# EAGLE schematic buttons+tft-fix (EAGLE 9.2.2)
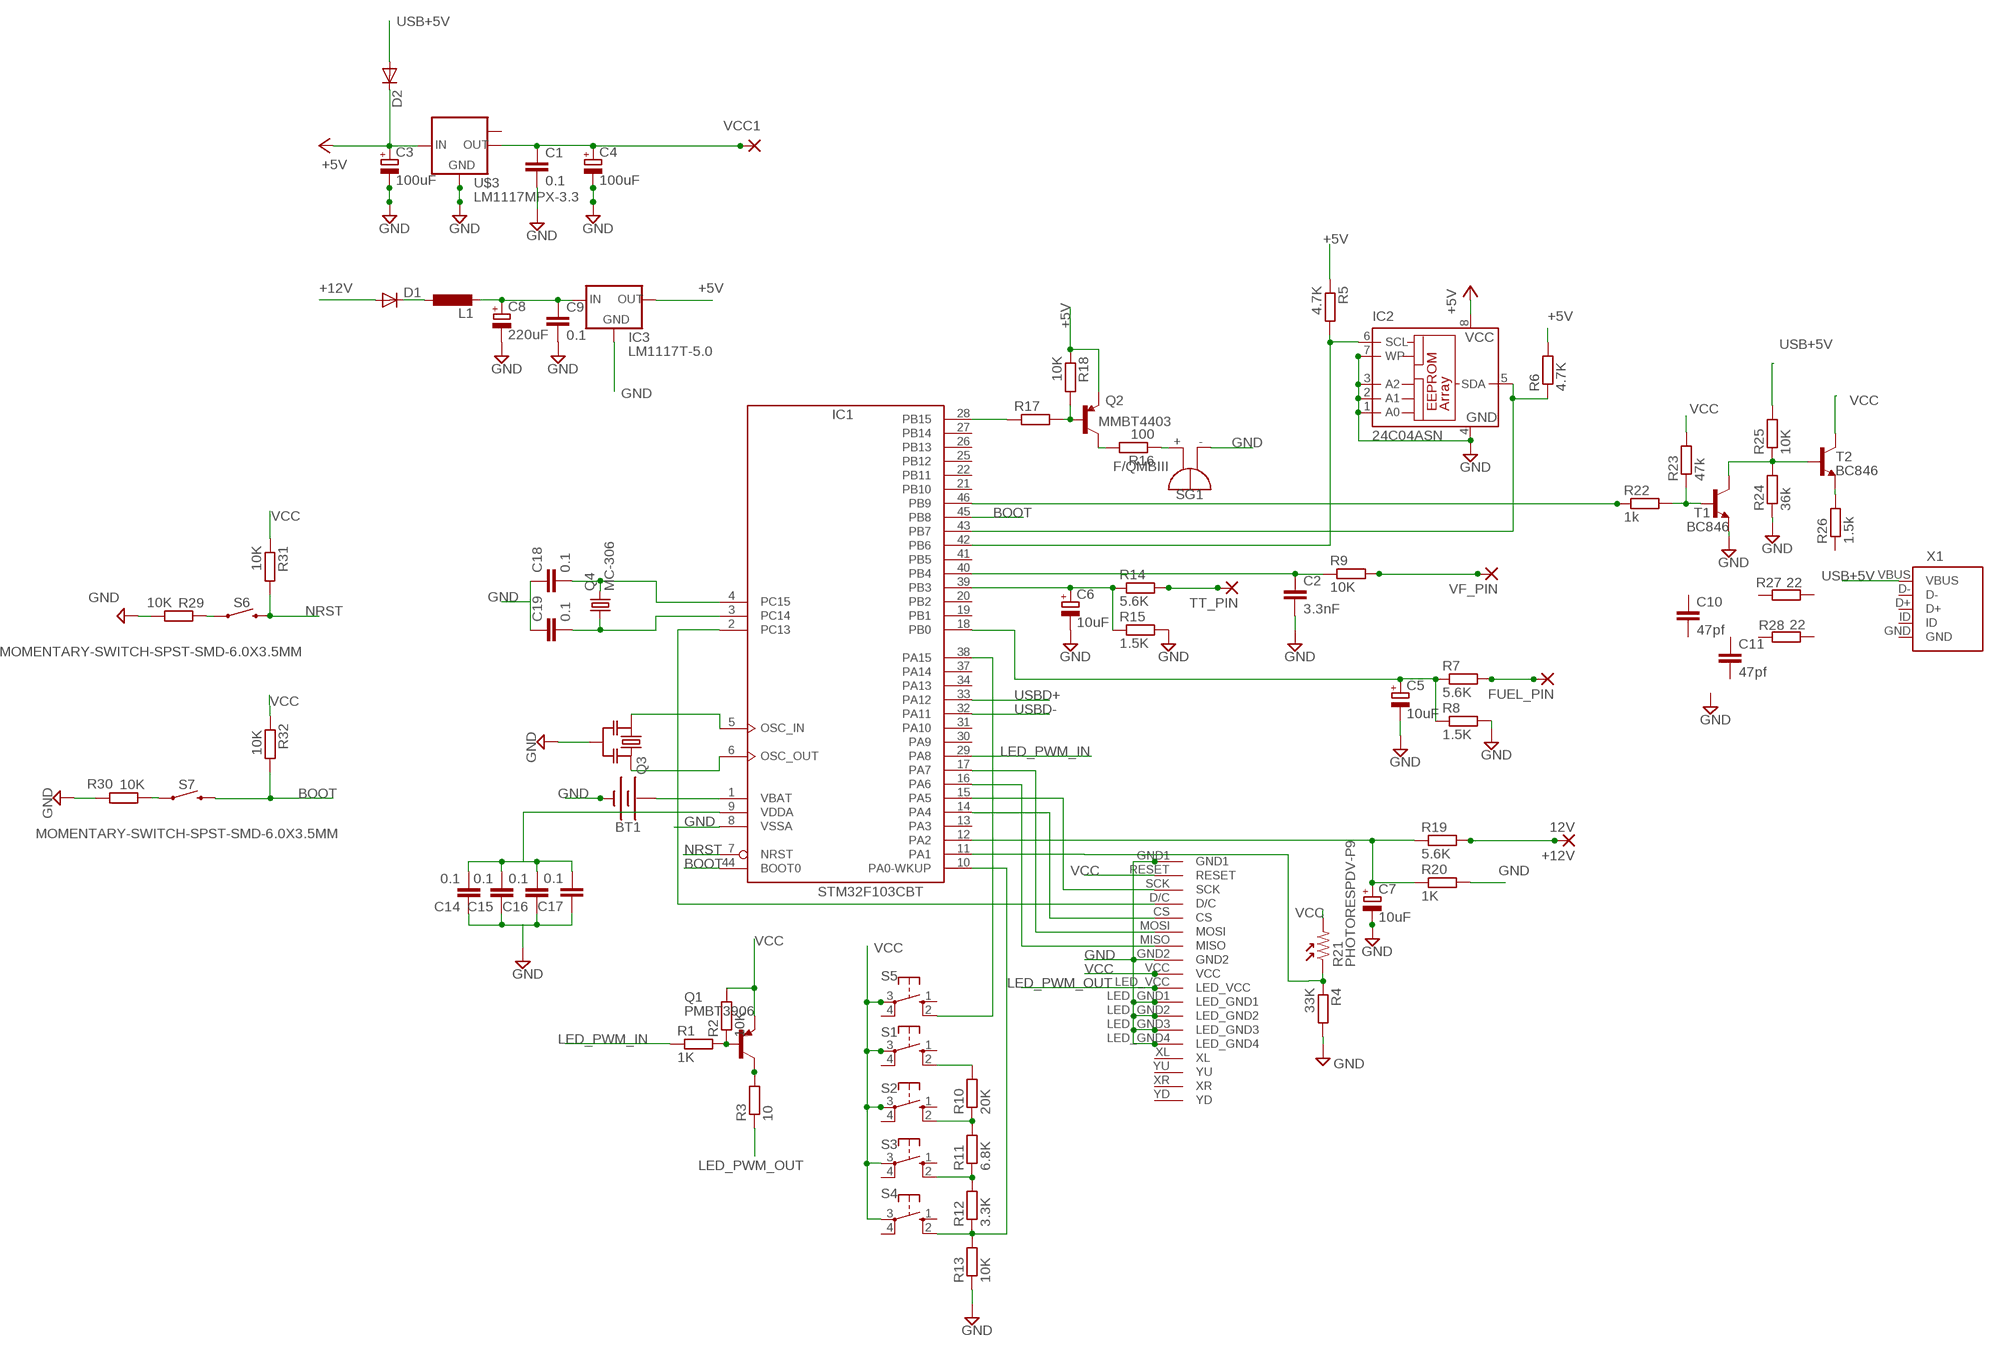
[diagram p0: schematic, sheet 1]

## Parts
+12V  12V  2,54/0,8  [2,54/0,8]
BT1  BATTERY  [BATTCOM_20MM_VERTICAL]
C1  0.1  C-EUC0805  [C0805]
C2  3.3nF  C-EUC0805  [C0805]
C3  100uF  CPOL-EUSMCB  [SMC_B]
C4  100uF  CPOL-EUSMCB  [SMC_B]
C5  10uF  CPOL-EUSMCA  [SMC_A]
C6  10uF  CPOL-EUSMCA  [SMC_A]
C7  10uF  CPOL-EUSMCA  [SMC_A]
C8  220uF  CPOL-EUSMCB  [SMC_B]
C9  0.1  C-EUC0805  [C0805]
C10  47pf  C-EUC0805  [C0805]
C11  47pf  C-EUC0805  [C0805]
C14  0.1  C-EUC0805  [C0805]
C15  0.1  C-EUC0805  [C0805]
C16  0.1  C-EUC0805  [C0805]
C17  0.1  C-EUC0805  [C0805]
C18  0.1  C-EUC0805  [C0805]
C19  0.1  C-EUC0805  [C0805]
D1  DIODE-DO-214AC  [DO-214AC]
D2  DIODE-DO-214AC  [DO-214AC]
FUEL_PIN  2,15/1,0  [2,15/1,0]
IC1  STM32F103CBT  [LQFP48]
IC2  24C04ASN  [SO-08]
IC3  LM1117T-5.0  [TO220]
L1  L_EU-CDRH4D28  [INDUCTOR_CDRH4]
Q1  PMBT3906  MMBT4403LT1SMD  [SOT23-BEC]
Q2  MMBT4403  TRANSISTOR_PNPMMBT4403  [SOT23-3]
Q3  RESONATOR-MURATACST_CE  [RESONATOR_MURATA2]
Q4  MC-306  [MC-306]
R1  1K  R-EU_R0805  [R0805]
R2  10K  R-EU_R0805  [R0805]
R3  10  R-EU_R0805  [R0805]
R4  33K  R-EU_R0805  [R0805]
R5  4.7K  R-EU_R0805  [R0805]
R6  4.7K  R-EU_R0805  [R0805]
R7  5.6K  R-EU_R0805  [R0805]
R8  1.5K  R-EU_R0805  [R0805]
R9  10K  R-EU_R0805  [R0805]
R10  20K  R-EU_R0805  [R0805]
R11  6.8K  R-EU_R0805  [R0805]
R12  3.3K  R-EU_R0805  [R0805]
R13  10K  R-EU_R0805  [R0805]
R14  5.6K  R-EU_R0805  [R0805]
R15  1.5K  R-EU_R0805  [R0805]
R16  100  R-EU_R0805  [R0805]
R17  1K  R-EU_R0805  [R0805]
R18  10K  R-EU_R0805  [R0805]
R19  5.6K  R-EU_R0805  [R0805]
R20  1K  R-EU_R0805  [R0805]
R21  PHOTORESPDV-P9  [PDV-P9XXX]
R22  1k  R-EU_R0805  [R0805]
R23  47k  R-EU_R0805  [R0805]
R24  36k  R-EU_R0805  [R0805]
R25  10K  R-EU_R0805  [R0805]
R26  1.5k  R-EU_R0805  [R0805]
R27  22  R-EU_R0805  [R0805]
R28  22  R-EU_R0805  [R0805]
R29  10K  R-EU_R0805  [R0805]
R30  10K  R-EU_R0805  [R0805]
R31  10K  R-EU_R0805  [R0805]
R32  10K  R-EU_R0805  [R0805]
S1  10-XX  [B3F-10XX]
S2  10-XX  [B3F-10XX]
S3  10-XX  [B3F-10XX]
S4  10-XX  [B3F-10XX]
S5  10-XX  [B3F-10XX]
S6  MOMENTARY-SWITCH-SPST-SMD-6.0X3.5MM  [TACTILE_SWITCH_SMD_6.0X3.5MM]
S7  MOMENTARY-SWITCH-SPST-SMD-6.0X3.5MM  [TACTILE_SWITCH_SMD_6.0X3.5MM]
SG1  F/QMBIII  [F/QMBIII]
T1  BC846  [SOT23]
T2  BC846  [SOT23]
TT_PIN  2,15/1,0  [2,15/1,0]
U$1  TJC-024-9341  [TJC-024-9341]
U$3  LM1117MPX-3.3  [SOT223]
VCC1  2,15/1,0  [2,15/1,0]
VF_PIN  2,15/1,0  [2,15/1,0]
X1  USB-MINI-TH-VERTICAL  [USB-MINI_TH-VERTICAL]

## Nets
+5V: C3.+ D2.C IC2.8(VCC) IC3.2(OUT) Q2.2(E) R5.1 R6.2 R18.1 U$3.3(IN)
+12V: +12V.1(P) D1.A R19.2
BOOT: IC1.44(BOOT0) IC1.45(PB8) R32.2 S7.2
BUT1: R10.2 S1.2(S1)
BUT2: R10.1 R11.2 S2.2(S1)
BUT3: R11.1 R12.2 S3.2(S1)
BUT_PIN: IC1.10(PA0-WKUP) R12.1 R13.2 S4.2(S1)
FUEL_PIN: FUEL_PIN.1(P) R7.2
FUEL_PIN1: C5.+ IC1.18(PB0) R7.1 R8.1
GND: BT1.3(-) C1.2 C2.2 C3.- C4.- C5.- C6.- C7.- C8.- C9.2 C14.1 C15.1 C16.1 C17.1 IC1.8(VSSA) IC2.1(A0) IC2.2(A1) IC2.3(A2) IC2.4(GND) IC2.7(WP) IC3.1(GND) Q3.2 R4.2 R8.2 R13.1 R15.2 R20.2 R24.1 R29.2 R30.2 SG1.-(+) T1.2(E) U$1.GND1 U$1.GND2 U$1.LED_GND1 U$1.LED_GND2 U$1.LED_GND3 U$1.LED_GND4 U$3.1(GND)
LED: Q1.C R3.2
LED_PWM_IN: IC1.29(PA8) R1.1
LED_PWM_OUT: R3.1 U$1.LED_VCC
N$1: IC1.38(PA15) S5.2(S1)
N$2: IC1.42(PB6) IC2.6(SCL) R5.2
N$3: Q1.B R1.2 R2.1
N$4: IC1.17(PA7) U$1.MOSI
N$5: IC1.16(PA6) U$1.MISO
N$6: IC1.15(PA5) U$1.SCK
N$7: C8.+ C9.1 IC3.3(IN) L1.2
N$8: IC1.14(PA4) U$1.CS
N$9: IC1.2(PC13) U$1.D/C
N$10: D1.C L1.1
N$11: C14.2 C15.2 C16.2 C17.2
N$12: R24.2 R25.1 T1.3(C) T2.1(B)
N$13: IC1.28(PB15) R17.1
N$14: R22.2 T1.1(B)
N$15: Q2.1(B) R17.2 R18.2
N$16: Q2.3(C) R16.2
N$17: R16.1 SG1.+(-)
N$20: IC1.43(PB7) IC2.5(SDA) R6.1
N$21: R26.2 T2.2(E)
N$22: R29.1 S6.1
N$23: C7.+ IC1.12(PA2) R19.1 R20.1
N$24: IC1.9(VDDA)
N$27: IC1.5(OSC_IN) Q3.1
N$28: C18.2 IC1.4(PC15) Q4.4
N$29: IC1.6(OSC_OUT) Q3.3
N$30: R30.1 S7.1
N$31: C19.2 Q4.1
N$32: C18.1 C19.1
N$34: IC1.3(PC14)
N$36: R23.1
N$37: IC1.46(PB9) R22.1
NRST: IC1.7(NRST) R31.2 S6.2
PHOTORE_PIN: IC1.11(PA1) R4.1 R21.1
TT_PIN1: R14.2 TT_PIN.1(P)
TT_PIN_2: C6.+ IC1.39(PB3) R14.1 R15.1
USB+5V: D2.A R25.2 X1.VBUS
USBD+: IC1.33(PA12)
USBD-: IC1.32(PA11)
VBAT1: BT1.1(+) BT1.2(+) IC1.1(VBAT)
VCC: C1.1 C4.+ Q1.E R2.2 R21.2 R23.2 R31.1 R32.1 S1.3(P) S2.3(P) S3.3(P) S4.3(P) S5.3(P) T2.3(C) U$1.RESET U$1.VCC U$3.2(OUT) VCC1.1(P)
VF_PIN: C2.1 IC1.40(PB4) R9.1
VF_PIN1: R9.2 VF_PIN.1(P)
Unconnected: C10.1 C10.2 C11.1 C11.2 IC1.13(PA3) IC1.19(PB1) IC1.20(PB2) IC1.21(PB10) IC1.22(PB11) IC1.25(PB12) IC1.26(PB13) IC1.27(PB14) IC1.30(PA9) IC1.31(PA10) IC1.34(PA13) IC1.37(PA14) IC1.41(PB5) R26.1 R27.1 R27.2 R28.1 R28.2 S1.1(S) S1.4(P1) S2.1(S) S2.4(P1) S3.1(S) S3.4(P1) S4.1(S) S4.4(P1) S5.1(S) S5.4(P1) U$1.XL U$1.XR U$1.YD U$1.YU U$3.TAB(OUT1) X1.D+ X1.D- X1.ID

## Power pins joined to a net without a drawn wire
GND: X1.GND
VDD: IC1.24(VDD) IC1.36(VDD) IC1.48(VDD)
VSS: IC1.23(VSS) IC1.35(VSS) IC1.47(VSS)

## Library data of the parts
+12V = wirepad:2,54/0,8: THROUGH-HOLE PAD
BT1 = SparkFun-Batteries:BATTERY: Battery - Single Cell A variety of battery chemistries, sizes, and footprints. Device List: 20MM_PTH - Coin Cell Battery Holder - 20mm (PTH) <https://www.sparkfun.com/products/783> 6.8MM_PTH - Coin Cell Battery Holder - 6.8MM(SMD) <https://www.digikey.com/product-detail/en/seiko-instruments/MS621FE-FL11E/728-1057-ND/1889208?WT.srch=1&gclid=CNOQ5a6LzdQCFZS2wAodXCkE0g> 12MM_SMD - Coin Cell Battery Holder - 12mm (SMD) <https://www.sparkfun.com/products/10592> 12MM_PTH - Coin Cell Battery Holder - 12mm (PTH) <https://www.sparkfun.com/products/7948> 20MM_SMD - 20mm Coin Cell Battery Holder (SMD) (2 legs) Used on the Big Time Watch Kit <https://www.sparkfun.com/products/11734> 20MM_SMD_4LEGS - Coin Cell Battery Holder - 20mm (SMD) <https://www.sparkfun.com/products/11892> 20MM_SMD_4LEGS_OVERPASTE - Coin Cell Battery Holder - 20mm (SMD) <https://www.sparkfun.com/products/11892> (Over-paste on the legs) 24.5MM_PTH - Coin Cell Battery Holder - 24.5mm (PTH) <https://www.sparkfun.com/products/8863> 9V - 9V Battery Holder - PC Mount Used on the SparkFun SparkPunk Sound Kit <https://www.sparkfun.com/products/11177> and SparkFun SparkPunk Sequencer Kit <https://www.sparkfun.com/products/12707> 18650 - Battery Holder - 18650 (PTH) <https://www.sparkfun.com/products/13113> AA - Battery Holder - 1xAA (PTH) <https://www.sparkfun.com/products/7949> AAA - Battery Holder - 1xAAA (PTH) <https://www.sparkfun.com/products/12718> AA_KIT - Battery Holder - 1xAA (PTH) <https://www.sparkfun.com/products/7949> Special kit package - pads only have exposed copper on one side of the board. AAA_KIT - Battery Holder - 1xAAA (PTH) <https://www.sparkfun.com/products/12718> Special kit package - pads only have exposed copper on one side of the board.
C1 C2 C9-C11 C14-C19 = rcl:C-EU: CAPACITOR, European symbol; SPICEPREFIX: C
C3 C4 C8 = rcl:CPOL-EU: POLARIZED CAPACITOR, European symbol; SPICEPREFIX: C
C5-C7 = resistor:CPOL-EU: POLARIZED CAPACITOR, European symbol
D1 D2 = diode:DIODE-: DIODE
FUEL_PIN = wirepad:2,15/1,0: THROUGH-HOLE PAD; SPICEPREFIX: X
IC1 = micro-stm_v3:STM32F103C*T: ARM 32-bit Cortex™-M3 CPU 72 MHz maximum frequency 16 to 128 Kbytes of Flash memory 6 to 20 kbytes of SRAM 37 GPIOs 2.0 to 3.6 V application supply
IC2 = microchip:24C*: Serial EEPROM 1 K/2 K/4 K; OC_FARNELL: unknown; OC_NEWARK: unknown
IC3 = lm1117:LM1117T-*
L1 = m-pad-2.1:L_EU: Inductors in various packages from: - Sumida - Panasonic - Coilcraft
Q1 = transistor-pnp:MMBT4403*: PNP Transistror
Q2 = User-Submitted:TRANSISTOR_PNP: Generic PNP BJT Double check pinouts against datasheets- not all devices are the same! MMBT3906 - 40V 200mA SOT-23 (TRANS-08052) MMBT4403 - 40V 600mA SOT-23 (TRANS-09245); PROD_ID: TRANS-09245
Q3 = m-pad-2.1:RESONATOR-MURATA: Murata ceramic Resonator "ceralock" CSTCE series with built in load capacitance +- 0.5% tolerance 12.51MHz to 19.99MHz 16MHz murata part#: CSTCE16M0V53-R0 16MHz digikey part#: 490-1198-1-ND $1.33 each
Q4 = crystal:MC-306: kHz RANGE CRYSTAL UNIT SMD Source: MC-306_405_406_E07X.PDF Homepage <http://www.epsontoyocom.co.jp>; MPN: MC-306 60.0KHZ 100PPM ,12.5PF; OC_FARNELL: 1278040; OC_NEWARK: 31M5576
R1-R20 R22-R32 = resistor:R-EU_: RESISTOR, European symbol
R21 = my_mixed:PHOTORES: Photoresistor
S1-S5 = switch-omron:10-XX: OMRON SWITCH; MPN: B3F-1000; OC_FARNELL: 176432; OC_NEWARK: 36M3542
S6 S7 = SparkFun-Switches:MOMENTARY-SWITCH-SPST: Momentary Switch (Pushbutton) - SPST Normally-open (NO) SPST momentary switches (buttons, pushbuttons). Variants PTH-12MM - 12mm square, through-hole Momentary Pushbutton Switch - 12mm Square <https://www.sparkfun.com/products/9190> (COM-09190) PTH-6.0MM, PTH-6.0MM-KIT - 6.0mm square, through-hole Mini Pushbutton Switch <https://www.sparkfun.com/products/97> (COM-00097) KIT package intended for soldering kit's - only one side of pads' copper is exposed. PTH-RIGHT-ANGLE-KIT - Right-angle, through-hole Right Angle Tactile Button <https://www.sparkfun.com/products/10791> - Used on SparkFun BigTime Watch Kit <https://www.sparkfun.com/products/11734> SMD-12MM - 12mm square, surface-mount Tactile Button - SMD (12mm) <https://www.sparkfun.com/products/12993> (COM-12993) Used on SparkFun PicoBoard <https://www.sparkfun.com/products/11888> SMD-4.5MM - 4.5mm Square Trackball Switch Used on SparkFun Blackberry Trackballer Breakout <https://www.sparkfun.com/products/13169> SMD-4.6MMX2.8MM - 4.60mm x 2.80mm, surface mount Used on SparkFun SAMD21 Mini Breakout <https://www.sparkfun.com/products/13664> SMD-5.2MM, SMD-5.2-REDUNDANT - 5.2mm square, surface-mount Mini Pushbutton Switch - SMD <https://www.sparkfun.com/products/8720> (COM-08720) Used on Arduino Pro Mini <https://www.sparkfun.com/products/11114> REDUNDANT package connects both switch circuits together SMD-6.0X3.5MM - 6.0 x 3.5mm, surface mount Momentary Reset Switch SMD <https://www.sparkfun.com/products/8229> (COM-08229) SMD-6.2MM-TALL - 6.2mm square, surface mount Tactile Button - SMD (6mm) <https://www.sparkfun.com/products/12992> Used on SparkFun Digital Sandbox <https://www.sparkfun.com/products/12651> SMD-RIGHT-ANGLE - Right-angle, surface mount Used on SparkFun Block for Intel® Edison - Arduino <https://www.sparkfun.com/products/13036>; PROD_ID: SWCH-00815; SF_SKU: COM-08229
SG1 = buzzer:F/QMBIII: BUZZER Source: Buerklin; OC_FARNELL: unknown; OC_NEWARK: unknown
T1 T2 = transistor-neu-to92:BC846: NPN TRANSISTOR
TT_PIN VCC1 VF_PIN = wirepad:2,15/1,0: THROUGH-HOLE PAD
U$1 = diy-modules:TJC-024-9341
U$3 = lm1117:LM1117MPX-*
X1 = kanflo:USB-MINI-TH-VERTICAL: Vertical USB mini through hole connector A low cost vertical USB mini connector from eBay, found here <http://www.ebay.com/itm/181392933768>.